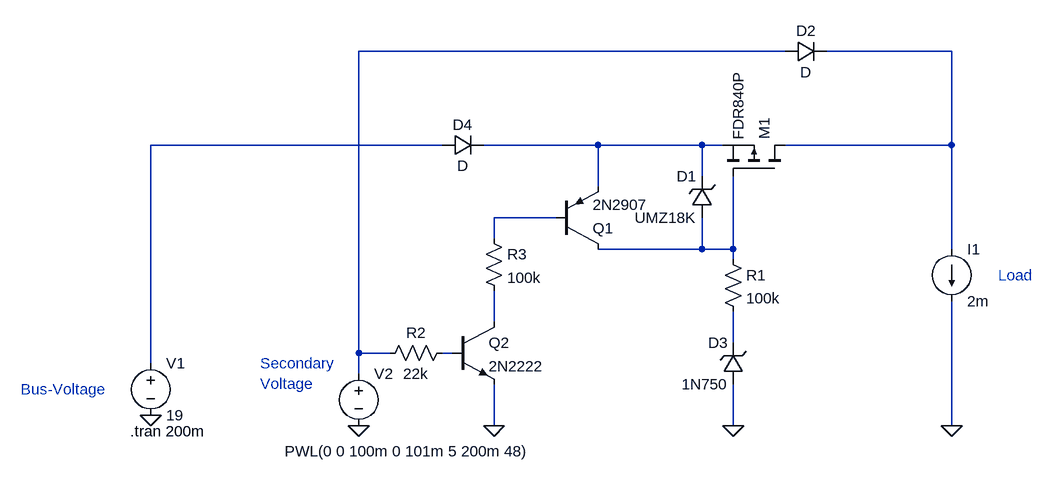
[diagram p0: schematic BusVoltage_Cutoff.asc]
BusVoltage_Cutoff.asc, the LTspice schematic file:
Version 4
SHEET 1 1240 680
WIRE 464 -368 -192 -368
WIRE 720 -368 528 -368
WIRE -64 -224 -512 -224
WIRE 176 -224 0 -224
WIRE 336 -224 176 -224
WIRE 368 -224 336 -224
WIRE 720 -224 720 -368
WIRE 720 -224 464 -224
WIRE 336 -176 336 -224
WIRE 176 -160 176 -224
WIRE 112 -112 16 -112
WIRE 16 -80 16 -112
WIRE 336 -64 336 -112
WIRE 336 -64 176 -64
WIRE 384 -64 384 -176
WIRE 384 -64 336 -64
WIRE 720 -64 720 -224
WIRE 384 -48 384 -64
WIRE 16 48 16 0
WIRE 384 80 384 32
WIRE -192 96 -192 -368
WIRE -144 96 -192 96
WIRE -48 96 -64 96
WIRE -512 112 -512 -224
WIRE -192 128 -192 96
WIRE 16 208 16 144
WIRE 384 208 384 144
WIRE 720 208 720 16
FLAG -512 192 0
FLAG 384 208 0
FLAG 720 208 0
FLAG -192 208 0
FLAG 16 208 0
SYMBOL voltage -512 96 R0
WINDOW 123 0 0 Left 0
WINDOW 39 0 0 Left 0
SYMATTR InstName V1
SYMATTR Value 19
SYMBOL pmos 464 -176 M270
SYMATTR InstName M1
SYMATTR Value FDR840P
SYMBOL res 368 -64 R0
SYMATTR InstName R1
SYMATTR Value 100k
SYMBOL pnp 112 -64 M180
SYMATTR InstName Q1
SYMATTR Value 2N2907
SYMBOL voltage -192 112 R0
WINDOW 3 -114 135 Left 2
WINDOW 123 0 0 Left 0
WINDOW 39 0 0 Left 0
SYMATTR Value PWL(0 0 100m 0 101m 5 200m 48)
SYMATTR InstName V2
SYMBOL zener 352 -112 R180
WINDOW 0 24 64 Left 2
WINDOW 3 24 0 Left 2
SYMATTR InstName D1
SYMATTR Value UMZ18K
SYMBOL diode 464 -352 R270
WINDOW 0 32 32 VTop 2
WINDOW 3 0 32 VBottom 2
SYMATTR InstName D2
SYMBOL res 0 -96 R0
SYMATTR InstName R3
SYMATTR Value 100k
SYMBOL zener 400 144 R180
WINDOW 0 24 64 Left 2
WINDOW 3 24 0 Left 2
SYMATTR InstName D3
SYMATTR Value 1N750
SYMBOL current 720 -64 R0
WINDOW 123 0 0 Left 0
WINDOW 39 0 0 Left 0
SYMATTR InstName I1
SYMATTR Value 2m
SYMBOL diode -64 -208 R270
WINDOW 0 32 32 VTop 2
WINDOW 3 0 32 VBottom 2
SYMATTR InstName D4
SYMBOL npn -48 48 R0
SYMATTR InstName Q2
SYMATTR Value 2N2222
SYMBOL res -160 112 R270
WINDOW 0 32 56 VTop 2
WINDOW 3 0 56 VBottom 2
SYMATTR InstName R2
SYMATTR Value 22k
TEXT 792 -24 Left 2 ;Load
TEXT -544 216 Left 2 !.tran 200m
TEXT -712 152 Left 2 ;Bus-Voltage
TEXT -344 112 Left 2 ;Secondary\nVoltage

The netlist it stands for:
* BusVoltage_Cutoff.asc
V1 N003 0 19
M1 N002 N006 N004 N004 FDR840P
R1 N006 N008 100k
Q1 N006 N005 N004 0 2N2907
V2 N001 0 PWL(0 0 100m 0 101m 5 200m 48)
D1 N006 N004 UMZ18K
D2 N001 N002 D
R3 N005 N007 100k
D3 0 N008 1N750
I1 N002 0 2m
D4 N003 N004 D
Q2 N007 N009 0 0 2N2222
R2 N001 N009 22k
.model D D
.lib standard.dio
.model NPN NPN
.model PNP PNP
.lib standard.bjt
.model NMOS NMOS
.model PMOS PMOS
.lib standard.mos
* Load
.tran 200m
* Bus-Voltage
* Secondary
* Voltage
.backanno
.end